# EAGLE schematic Petra (EAGLE 7.7.0)
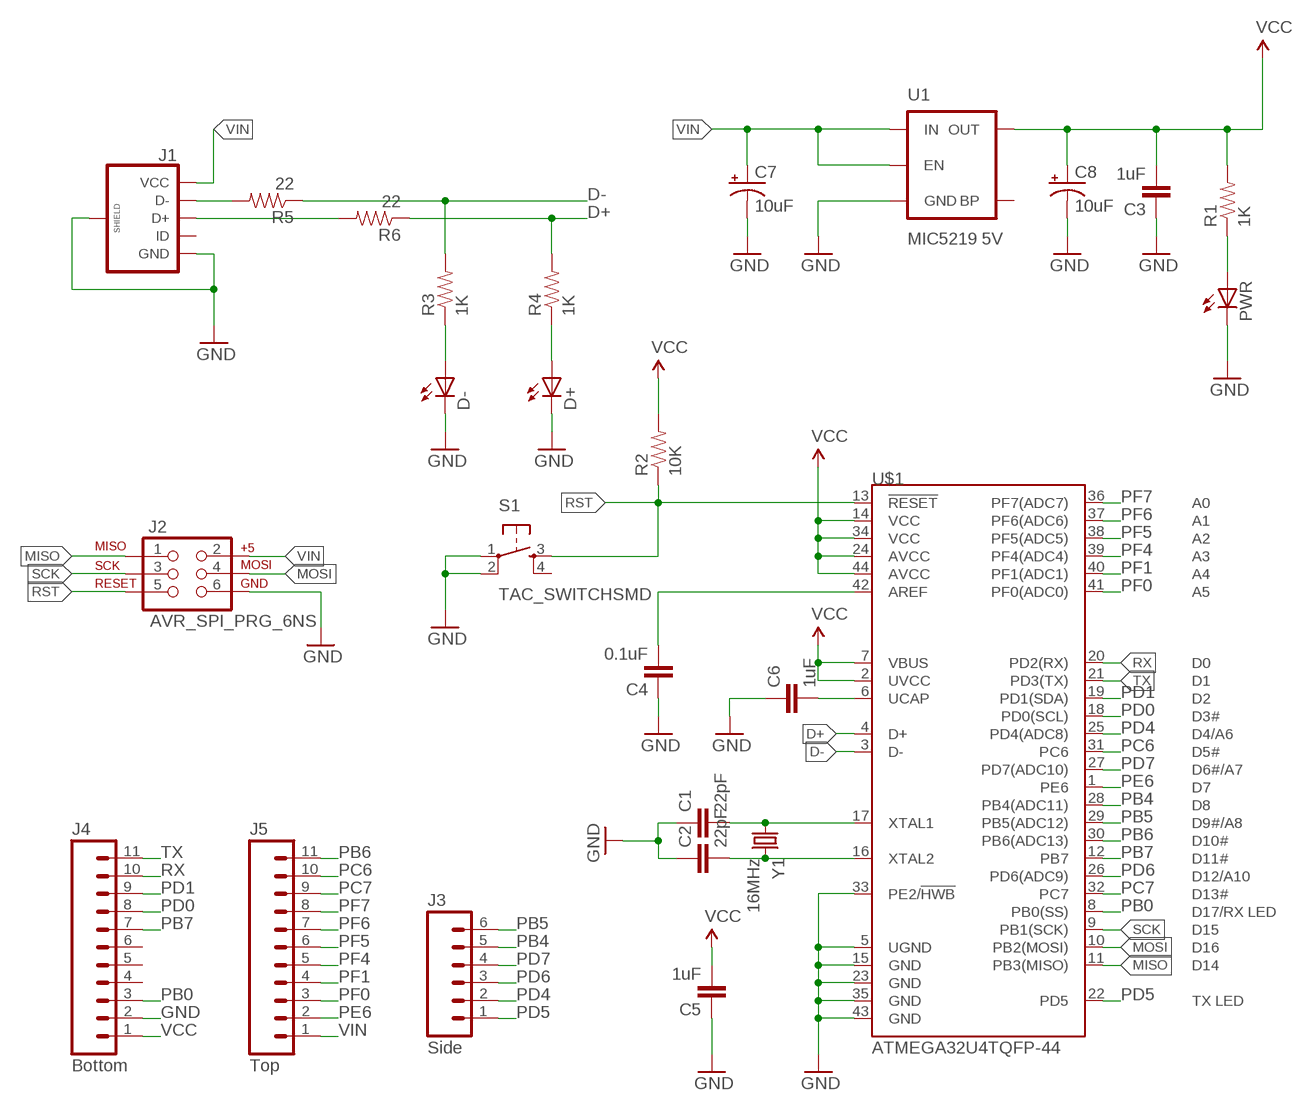
[diagram p0: schematic, sheet 1]

## Parts
C1  22pF  CAP0402-CAP  [0402-CAP]
C2  22pF  CAP0402-CAP  [0402-CAP]
C3  1uF  CAP0402-CAP  [0402-CAP]
C4  0.1uF  CAP0402-CAP  [0402-CAP]
C5  1uF  CAP0402-CAP  [0402-CAP]
C6  1uF  CAP0402-CAP  [0402-CAP]
C7  10uF  CAP_POL1206  [EIA3216]
C8  10uF  CAP_POL1206  [EIA3216]
D+  LEDCHIP-LED0805  [CHIP-LED0805]
D-  LEDCHIP-LED0805  [CHIP-LED0805]
J1  USB_MICROB_PLUGCONN-11752  [USB-B-MICRO-SMD_V03]
J2  AVR_SPI_PRG_6NS  [2X3-NS]
J3  Side  HEADER_1X06  [1X06]
J4  Bottom  HEADER_1X11  [1X11]
J5  Top  HEADER_1X11  [1X11]
PWR  LEDCHIP-LED0805  [CHIP-LED0805]
R1  1K  10KOHM-1/10W-1%(0603)0603  [0603-RES]
R2  10K  10KOHM-1/10W-1%(0603)0603  [0603-RES]
R3  1K  10KOHM-1/10W-1%(0603)0603  [0603-RES]
R4  1K  10KOHM-1/10W-1%(0603)0603  [0603-RES]
R5  22  10KOHM-1/10W-1%(0603)0603  [0603-RES]
R6  22  10KOHM-1/10W-1%(0603)0603  [0603-RES]
S1  TAC_SWITCHSMD  [TACTILE-SWITCH-SMD]
U1  MIC5219 5V  V_REG_MIC52195V  [SOT23-5]
U$1  ATMEGA32U4TQFP-44  [TQFP44]
Y1  16MHz  CRYSTALCRYSTAL-SMD-5X3-16MHZ  [CRYSTAL-SMD-5X3]

## Nets
D+: R4.2 R6.1 U$1.4(D+)
D-: R3.2 R5.1 U$1.3(D-)
GND: C1.1 C2.1 C3.1 C4.1 C5.1 C6.1 C7.C(-) C8.C(-) D+.C D-.C J1.GND J1.SHIELD1(SHIELD) J1.SHIELD2(SHIELD) J1.SHIELD3(SHIELD) J2.6 J4.2 PWR.C S1.1 S1.2 U1.2(GND) U$1.5(UGND) U$1.15(GND) U$1.23(GND) U$1.33(PE2/!HWB) U$1.35(GND) U$1.43(GND)
MISO: J2.1 U$1.11(PB3(MISO))
MOSI: J2.4 U$1.10(PB2(MOSI))
N$1: C1.2 U$1.17(XTAL1) Y1.1
N$2: C2.2 U$1.16(XTAL2) Y1.3
N$3: C6.2 U$1.6(UCAP)
N$4: C4.2 U$1.42(AREF)
N$5: J1.D- R5.2
N$6: J1.D+ R6.2
N$7: PWR.A R1.1
N$9: D+.A R4.1
N$11: D-.A R3.1
PB0: J4.3 U$1.8(PB0(SS))
PB4: J3.5 U$1.28(PB4(ADC11))
PB5: J3.6 U$1.29(PB5(ADC12))
PB6: J5.11 U$1.30(PB6(ADC13))
PB7: J4.7 U$1.12(PB7)
PC6: J5.10 U$1.31(PC6)
PC7: J5.9 U$1.32(PC7)
PD0: J4.8 U$1.18(PD0(SCL))
PD1: J4.9 U$1.19(PD1(SDA))
PD4: J3.2 U$1.25(PD4(ADC8))
PD5: J3.1 U$1.22(PD5)
PD6: J3.3 U$1.26(PD6(ADC9))
PD7: J3.4 U$1.27(PD7(ADC10))
PE6: J5.2 U$1.1(PE6)
PF0: J5.3 U$1.41(PF0(ADC0))
PF1: J5.4 U$1.40(PF1(ADC1))
PF4: J5.5 U$1.39(PF4(ADC4))
PF5: J5.6 U$1.38(PF5(ADC5))
PF6: J5.7 U$1.37(PF6(ADC6))
PF7: J5.8 U$1.36(PF7(ADC7))
RST: J2.5 R2.1 S1.3 U$1.13(!RESET)
RX: J4.10 U$1.20(PD2(RX))
SCK: J2.3 U$1.9(PB1(SCK))
TX: J4.11 U$1.21(PD3(TX))
VCC: C3.2 C5.2 C8.A(+) J4.1 R1.2 R2.2 U1.5(OUT) U$1.2(UVCC) U$1.7(VBUS) U$1.14(VCC) U$1.24(AVCC) U$1.34(VCC) U$1.44(AVCC)
VIN: C7.A(+) J1.VBUS(VCC) J2.2 J5.1 U1.1(IN) U1.3(EN)
Unconnected: J1.ID J4.4 J4.5 J4.6 S1.4 U1.4(BP)

## Library data of the parts
C1-C6 = SparkFun-Passives:CAP: Capacitor Standard 0603 ceramic capacitor, and 0.1" leaded capacitor.
C7 C8 = SparkFun-Passives:CAP_POL: Capacitor Polarized These are standard SMD and PTH capacitors. Normally 10uF, 47uF, and 100uF in electrolytic and tantalum varieties. Always verify the external diameter of the through hole cap, it varies with capacity, voltage, and manufacturer. The EIA devices should be standard.
D+ D- PWR = led:LED: LED OSRAM: - CHIPLED LG R971, LG N971, LY N971, LG Q971, LY Q971, LO R971, LY R971 LH N974, LH R974 LS Q976, LO Q976, LY Q976 LO Q996 - Hyper CHIPLED LW Q18S LB Q993, LB Q99A, LB R99A - SideLED LS A670, LO A670, LY A670, LG A670, LP A670 LB A673, LV A673, LT A673, LW A673 LH A674 LY A675 LS A676, LA A676, LO A676, LY A676, LW A676 LS A679, LY A679, LG A679 - Hyper Micro SIDELED® LS Y876, LA Y876, LO Y876, LY Y876 LT Y87S - SmartLED LW L88C, LW L88S LB L89C, LB L89S, LG L890 LS L89K, LO L89K, LY L89K LS L896, LA L896, LO L896, LY L896 - TOPLED LS T670, LO T670, LY T670, LG T670, LP T670 LSG T670, LSP T670, LSY T670, LOP T670, LYG T670 LG T671, LOG T671, LSG T671 LB T673, LV T673, LT T673, LW T673 LH T674 LS T676, LA T676, LO T676, LY T676, LB T676, LH T676, LSB T676, LW T676 LB T67C, LV T67C, LT T67C, LS T67K, LO T67K, LY T67K, LW E67C LS E67B, LA E67B, LO E67B, LY E67B, LB E67C, LV E67C, LT E67C LW T67C LS T679, LY T679, LG T679 LS T770, LO T770, LY T770, LG T770, LP T770 LB T773, LV T773, LT T773, LW T773 LH T774 LS E675, LA E675, LY E675, LS T675 LS T776, LA T776, LO T776, LY T776, LB T776 LHGB T686 LT T68C, LB T68C - Hyper Mini TOPLED® LB M676 - Mini TOPLED Santana® LG M470 LS M47K, LO M47K, LY M47K Source: http://www.osram.convergy.de LUXEON: - LUMILED® LXK2-PW12-R00, LXK2-PW12-S00, LXK2-PW14-U00, LXK2-PW14-V00 LXK2-PM12-R00, LXK2-PM12-S00, LXK2-PM14-U00 LXK2-PE12-Q00, LXK2-PE12-R00, LXK2-PE12-S00, LXK2-PE14-T00, LXK2-PE14-U00 LXK2-PB12-K00, LXK2-PB12-L00, LXK2-PB12-M00, LXK2-PB14-N00, LXK2-PB14-P00, LXK2-PB14-Q00 LXK2-PR12-L00, LXK2-PR12-M00, LXK2-PR14-Q00, LXK2-PR14-R00 LXK2-PD12-Q00, LXK2-PD12-R00, LXK2-PD12-S00 LXK2-PH12-R00, LXK2-PH12-S00 LXK2-PL12-P00, LXK2-PL12-Q00, LXK2-PL12-R00 Source: www.luxeon.com KINGBRIGHT: KA-3528ASYC Source: www.kingbright.com
J1 = SparkFun-Connectors:USB_MICROB_PLUG: USB Micro-B connectors Some male, some female. Watch your step!; PROD_ID: CONN-11752
J2 = SparkFun-Connectors:AVR_SPI_PRG_6: AVR ISP 6 Pin This is the reduced ISP connector for AVR programming. Common on Arduino. This footprint will take up less PCB space and can be used with a 10-pin to 6-pin adapter such as SKU: BOB-08508 **Special note about "TEST_POINT" package. The stop mask is on the top side, so if you want your programming test points to be on the bottom of your board, make sure to place this package on the bottom side of the board. This also ensure that the orientation to program from the bottom side will be correct.
J3 = PartsYouNeed:HEADER_1X06
J4 J5 = PartsYouNeed:HEADER_1X11
R1 R3-R6 = SparkFun-Resistors:10KOHM-1/10W-1%(0603): RES-00824; PROD_ID: RES-00824; VALUE: 10K
R2 = SparkFun-Resistors:10KOHM-1/10W-1%(0603): RES-00824; PROD_ID: RES-00824
S1 = SparkFun-Retired:TAC_SWITCH: Momentary Switch Button commonly used for reset or general input. Spark Fun Electronics SKU : COM-00097 SMT- SWCH-08247; PROD_ID: SWCH-08247
U1 = SparkFun-PowerIC:V_REG_MIC5219: V_REG MIC5219 Standard 3.3V and 5V 500mA LDO voltage regulator in SOT-23 layout. Micrel part MIC5219. BP (by-pass) pin is used to lower output noise with 470pF cap, may be left open.; PROD_ID: VREG-10107
U$1 = SparkFun-DigitalIC:ATMEGA32U4: Atmel 44-pin 8-bit Microcontroller with 32KBytes of ISP Flash and USB Controller
Y1 = SparkFun-FreqCtrl:CRYSTAL: Various standard crystals. Proven footprints.; PROD_ID: XTAL-08218

## Net classes
0 default: width 0.254 mm, drill 0.356 mm, clearance 0.203 mm